# Altium schematic sheet Channel.SchDoc
size A3
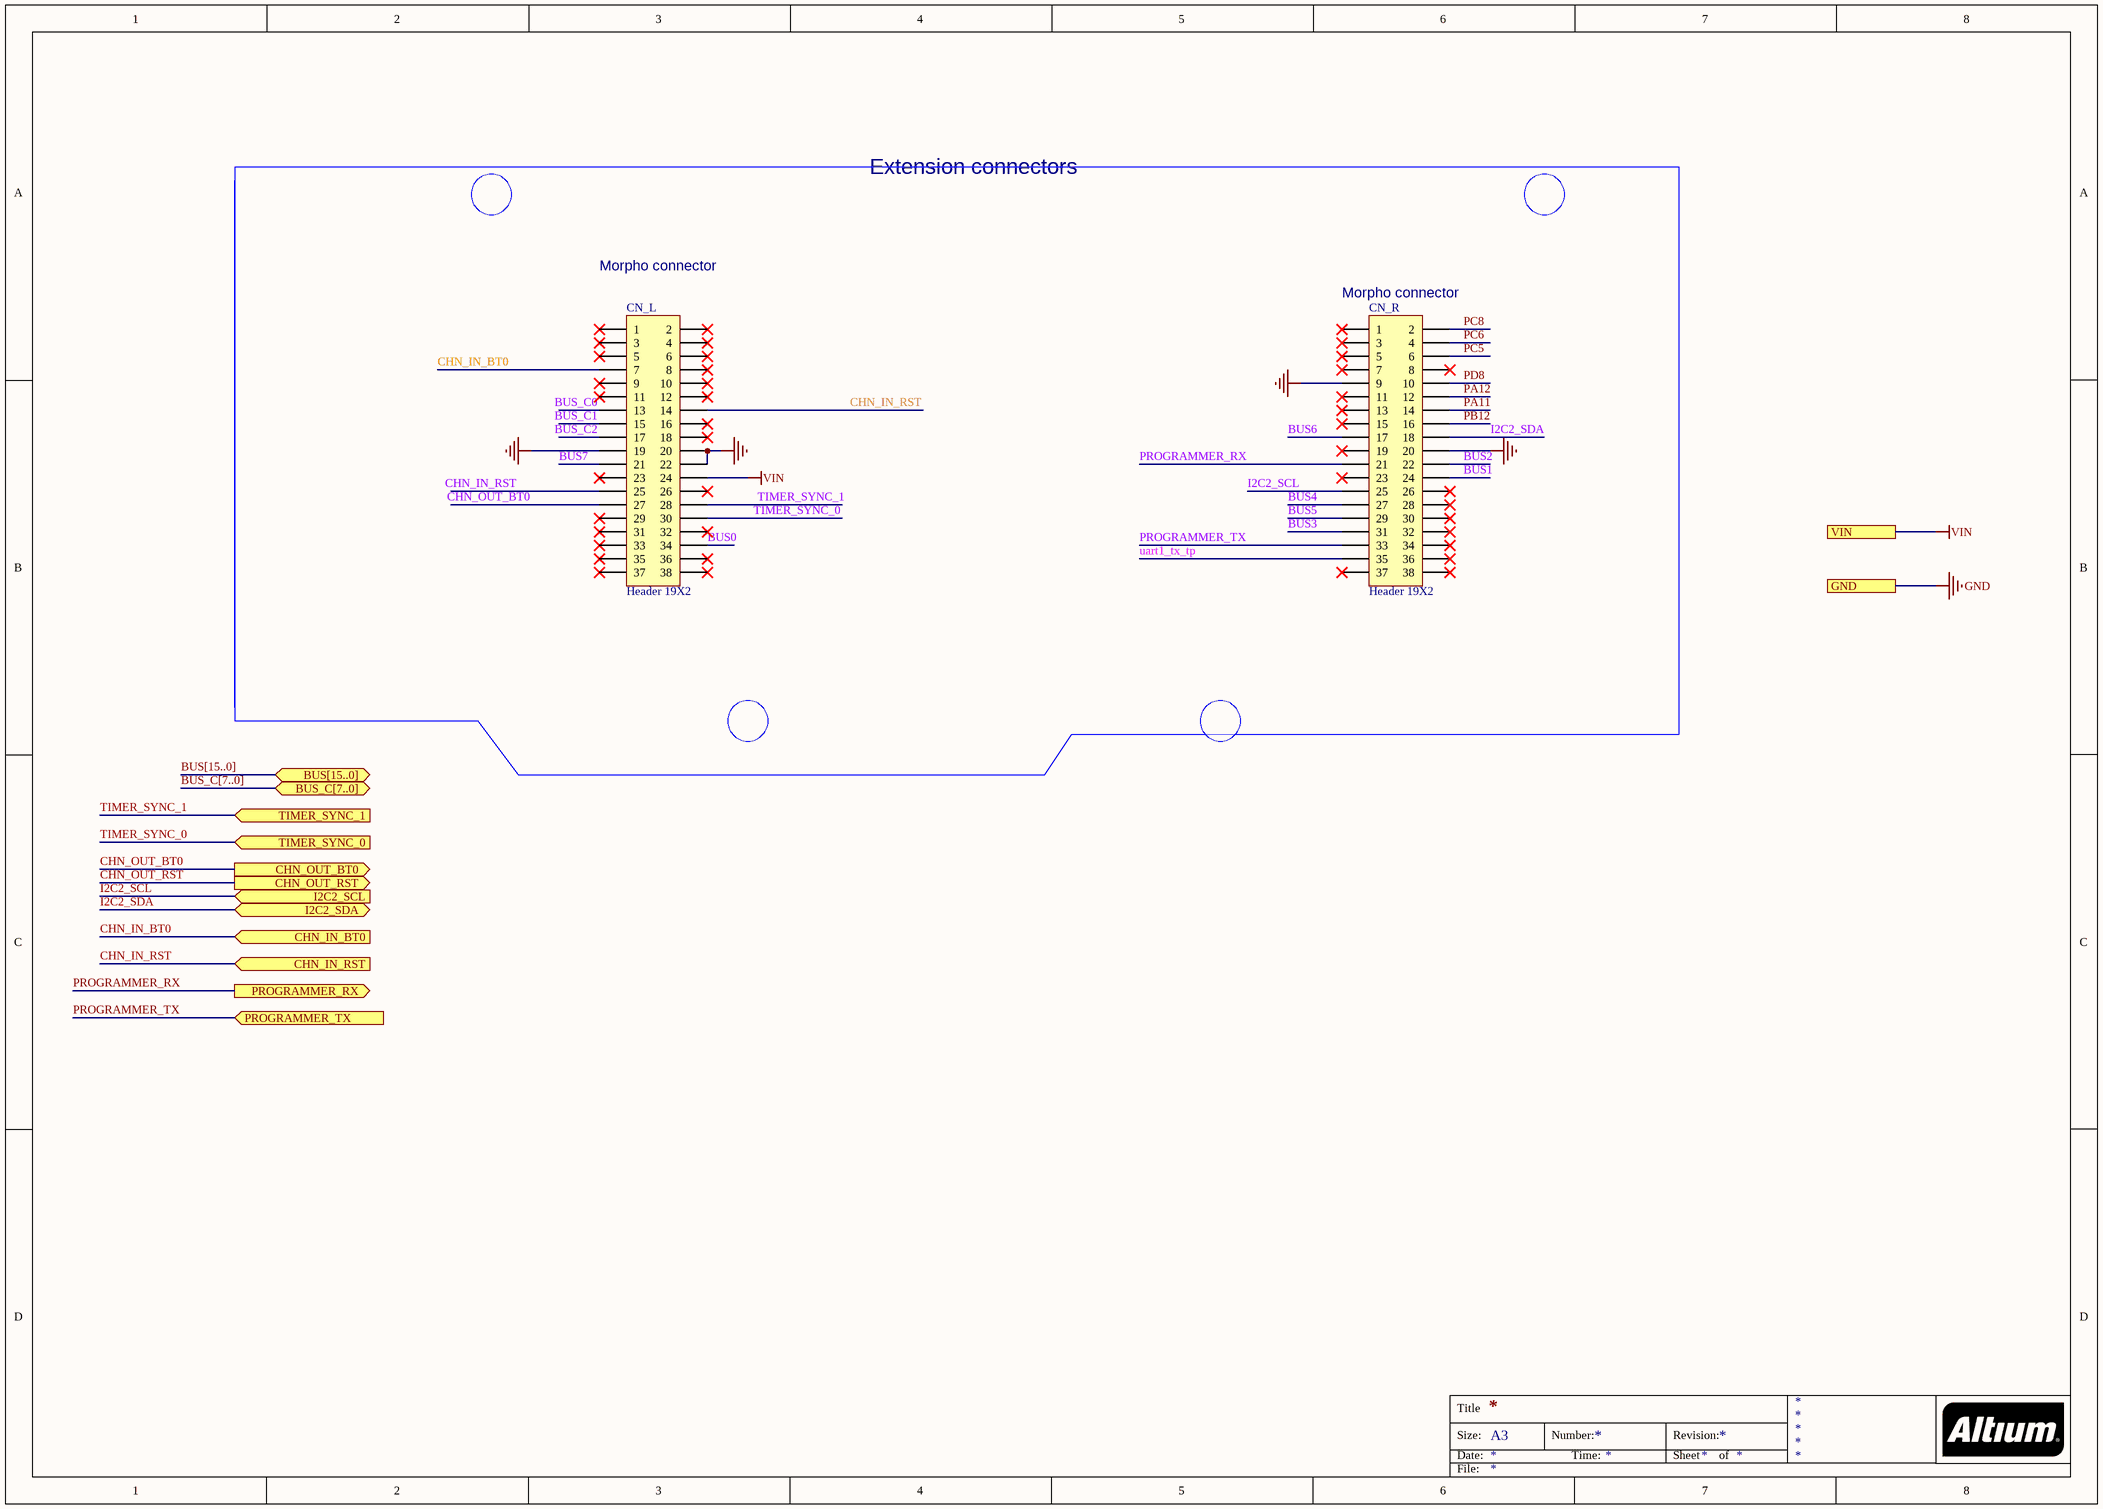
[diagram p0: Channel.SchDoc]

## Parts
CN_L  Header 19X2  [HDR2X19]
CN_R  Header 19X2  [HDR2X19]

## Blocks framed on the sheet
Extension connectors: CN_L CN_R

## Ports
BUS[15..0] (bidir), BUS_C[7..0] (bidir), CHN_IN_BT0 (in), CHN_IN_RST (in), CHN_OUT_BT0 (out), CHN_OUT_RST (out), GND, I2C2_SCL (in), I2C2_SDA (bidir), PROGRAMMER_RX (out), PROGRAMMER_TX (in), TIMER_SYNC_0 (in), TIMER_SYNC_1 (in), VIN

## Nets
GND: CN_L.19 CN_L.20 CN_L.22 CN_R.9 CN_R.20 ; port GND
VIN: CN_L.24 ; port VIN
BUS0: CN_L.34
BUS1: CN_R.24
BUS2: CN_R.22
BUS3: CN_R.31
BUS4: CN_R.27
BUS5: CN_R.29
BUS6: CN_R.17
BUS7: CN_L.21
BUS_C0: CN_L.13
BUS_C1: CN_L.15
BUS_C2: CN_L.17
CHN_IN_BT0: CN_L.7 ; port CHN_IN_BT0
CHN_IN_RST: CN_L.14 CN_L.25 ; port CHN_IN_RST
CHN_OUT_BT0: CN_L.27 ; port CHN_OUT_BT0
CHN_OUT_RST: port CHN_OUT_RST
I2C2_SCL: CN_R.25 ; port I2C2_SCL
I2C2_SDA: CN_R.18 ; port I2C2_SDA
PA11: CN_R.14
PA12: CN_R.12
PB12: CN_R.16
PC5: CN_R.6
PC6: CN_R.4
PC8: CN_R.2
PD8: CN_R.10
PROGRAMMER_RX: CN_R.21 ; port PROGRAMMER_RX
PROGRAMMER_TX: CN_R.33 ; port PROGRAMMER_TX
TIMER_SYNC_0: CN_L.30 ; port TIMER_SYNC_0
TIMER_SYNC_1: CN_L.28 ; port TIMER_SYNC_1
uart1_tx_tp: CN_R.35

Not connected (* = marked no-connect by the designer): CN_L 1* 2* 3* 4* 5* 6* 8* 9* 10* 11* 12* 16* 18* 23* 26* 29* 31* 32* 33* 35* 36* 37* 38*; CN_R 1* 3* 5* 7* 8* 11* 13* 15* 19* 23* 26* 28* 30* 32* 34* 36* 37* 38*

## Buses and harness runs
bus BUS[15..0] = port BUS[15..0]
bus BUS_C[7..0] = port BUS_C[7..0]

## Notes on the sheet
- Morpho connector
- (near CN_R) Morpho connector
- Title
- Size:
- Date:
- A3
- Number:
- Time:
- Revision:
- Sheet
- of
- File:

## Library data of the parts
CN_L CN_R = Header 19X2: Connectors, Interconnects / Rectangular Connectors - Headers, Receptacles, Female Sockets, 19-Hole, Dual row; Revision: 17-Jul-2002: Re-released for DXP Platform.; Publisher: Altium Limited; digikey: https://www.digikey.com/en/products/detail/te-connectivity-amp-connectors/4-1734506-2/4022265